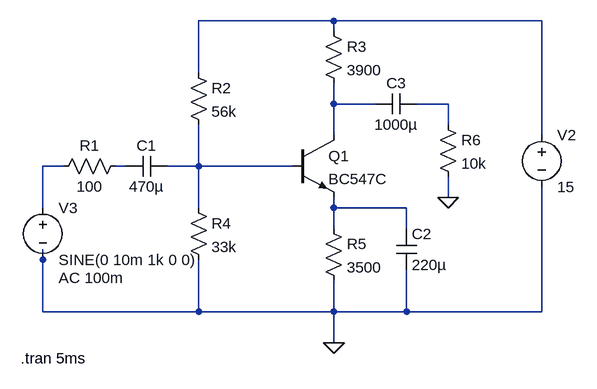
[diagram p0: schematic Draft1.asc]
Draft1.asc, the LTspice schematic file:
Version 4
SHEET 1 1000 680
WIRE 544 -96 336 -96
WIRE 864 -96 544 -96
WIRE 544 -80 544 -96
WIRE 336 -16 336 -96
WIRE 544 32 544 0
WIRE 608 32 544 32
WIRE 720 32 672 32
WIRE 720 64 720 32
WIRE 544 80 544 32
WIRE 864 80 864 -96
WIRE 128 128 96 128
WIRE 224 128 208 128
WIRE 336 128 336 64
WIRE 336 128 288 128
WIRE 480 128 336 128
WIRE 720 176 720 144
WIRE 96 192 96 128
WIRE 336 192 336 128
WIRE 544 192 544 176
WIRE 656 192 544 192
WIRE 544 224 544 192
WIRE 656 224 656 192
WIRE 96 272 96 256
WIRE 96 352 96 272
WIRE 336 352 336 272
WIRE 336 352 96 352
WIRE 544 352 544 304
WIRE 544 352 336 352
WIRE 656 352 656 288
WIRE 656 352 544 352
WIRE 864 352 864 160
WIRE 864 352 656 352
WIRE 544 400 544 352
FLAG 720 176 0
FLAG 544 400 0
SYMBOL res 224 112 R90
WINDOW 0 0 56 VBottom 2
WINDOW 3 32 56 VTop 2
SYMATTR InstName R1
SYMATTR Value 100
SYMBOL cap 288 112 R90
WINDOW 0 0 32 VBottom 2
WINDOW 3 32 32 VTop 2
SYMATTR InstName C1
SYMATTR Value 470µ
SYMBOL res 320 -32 R0
SYMATTR InstName R2
SYMATTR Value 56k
SYMBOL res 528 -96 R0
SYMATTR InstName R3
SYMATTR Value 3900
SYMBOL res 320 176 R0
SYMATTR InstName R4
SYMATTR Value 33k
SYMBOL voltage 864 64 R0
WINDOW 123 0 0 Left 0
WINDOW 39 0 0 Left 0
SYMATTR InstName V2
SYMATTR Value 15
SYMBOL voltage 96 176 R0
WINDOW 123 24 124 Left 2
WINDOW 39 0 0 Left 0
SYMATTR InstName V3
SYMATTR Value SINE(0 10m 1k 0 0)
SYMATTR Value2 AC 100m
SYMBOL npn 480 80 R0
SYMATTR InstName Q1
SYMATTR Value BC547C
SYMBOL res 528 208 R0
SYMATTR InstName R5
SYMATTR Value 3500
SYMBOL cap 640 224 R0
SYMATTR InstName C2
SYMATTR Value 220µ
SYMBOL cap 672 16 R90
WINDOW 0 0 32 VBottom 2
WINDOW 3 32 32 VTop 2
SYMATTR InstName C3
SYMATTR Value 1000µ
SYMBOL res 704 48 R0
SYMATTR InstName R6
SYMATTR Value 10k
TEXT 62 424 Left 2 !.tran 5ms

The netlist it stands for:
* Draft1.asc
R1 N005 N004 100
C1 N006 N005 470µ
R2 N001 N006 56k
R3 N001 N002 3900
R4 N006 0 33k
V2 N001 0 15
V3 N004 0 SINE(0 10m 1k 0 0) AC 100m
Q1 N002 N006 N007 0 BC547C
R5 N007 0 3500
C2 N007 0 220µ
C3 N003 N002 1000µ
R6 N003 0 10k
.model NPN NPN
.model PNP PNP
.lib standard.bjt
.tran 5ms
.backanno
.end